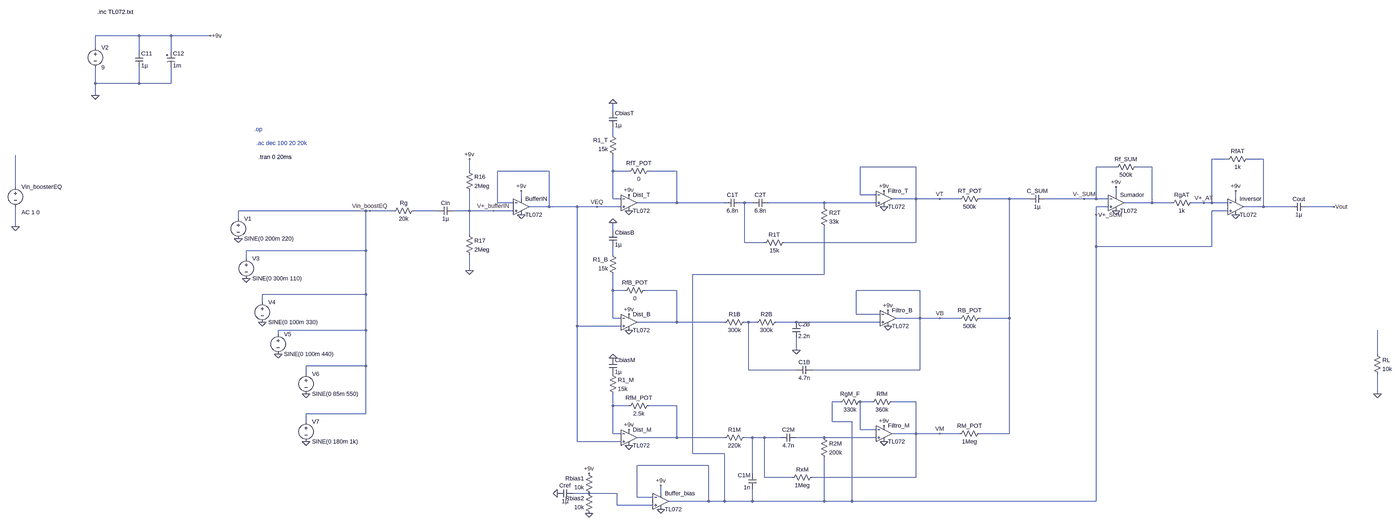
[diagram p0: schematic booster_eq.asc, whole sheet]
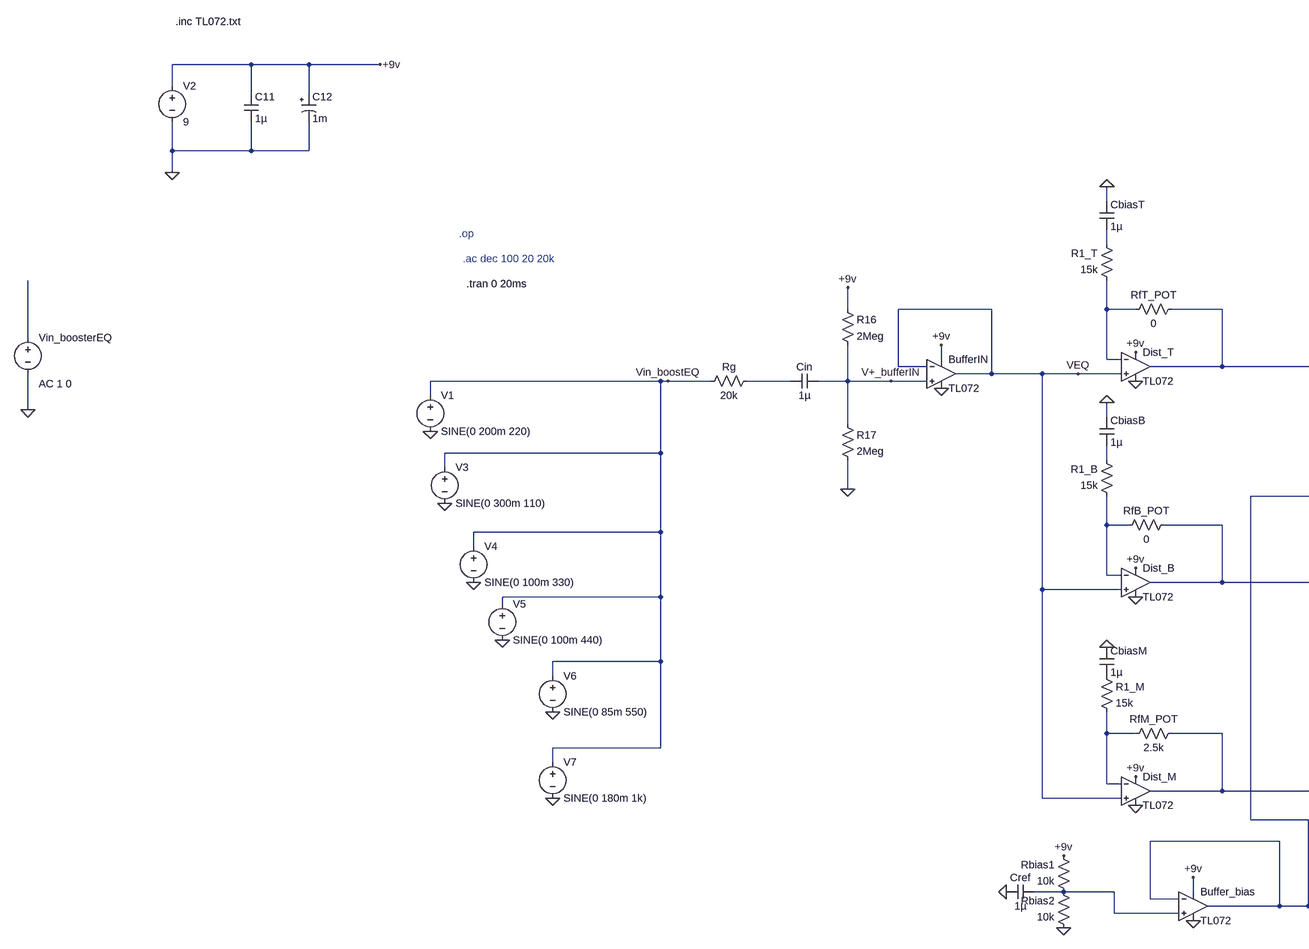
[diagram p1: schematic booster_eq.asc, part, row 1 of 1, column 1 of 2]
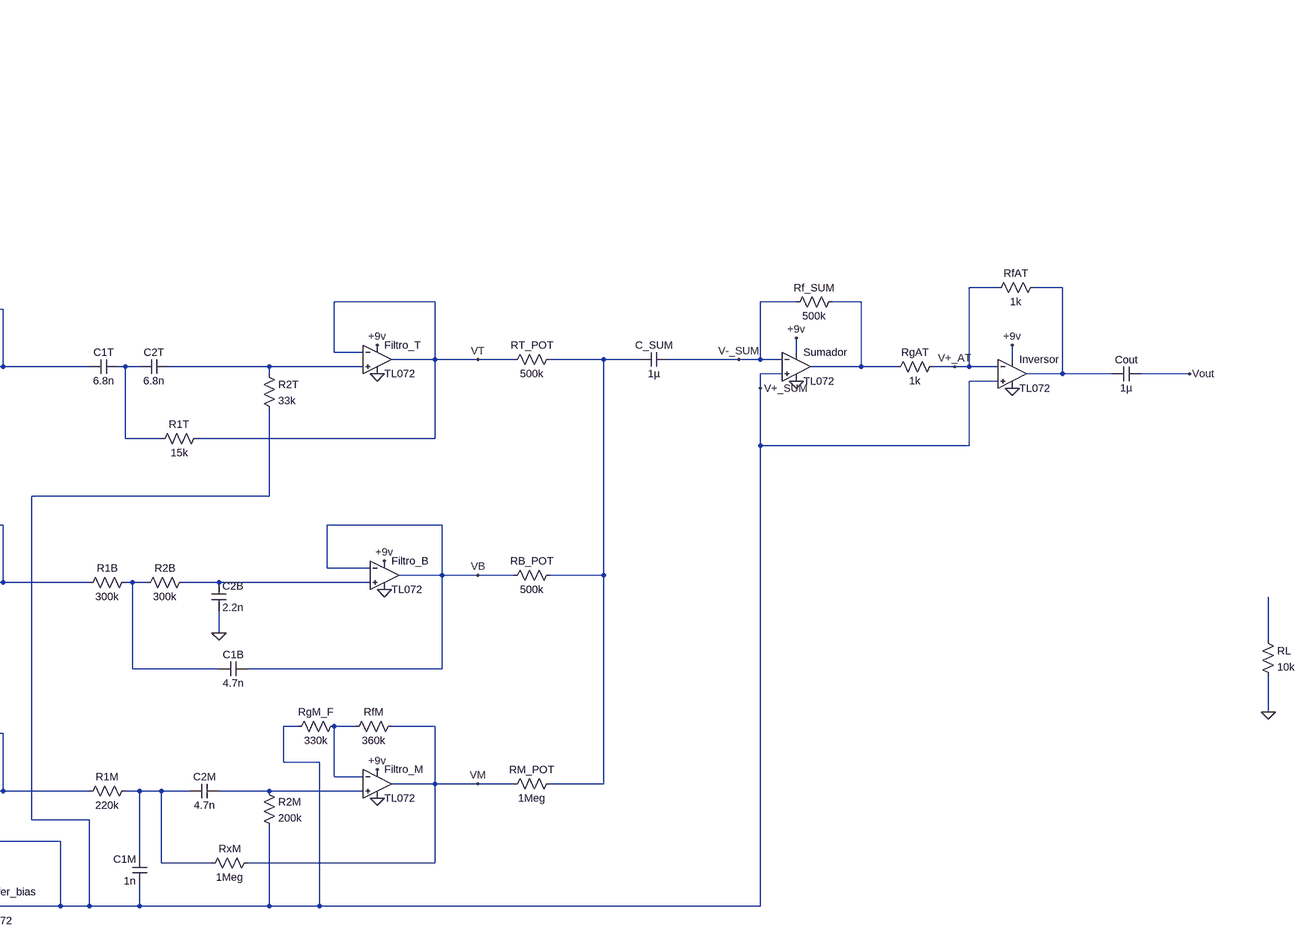
[diagram p2: schematic booster_eq.asc, part, row 1 of 1, column 2 of 2]
booster_eq.asc, the LTspice schematic file:
Version 4
SHEET 1 6752 4672
WIRE -2848 -16 -3024 -16
WIRE -2720 -16 -2848 -16
WIRE -2512 -16 -2720 -16
WIRE -3024 32 -3024 -16
WIRE -2848 48 -2848 -16
WIRE -2720 48 -2720 -16
WIRE -3024 176 -3024 112
WIRE -2848 176 -2848 112
WIRE -2848 176 -3024 176
WIRE -2720 176 -2720 112
WIRE -2720 176 -2848 176
WIRE -3024 224 -3024 176
WIRE -896 288 -896 256
WIRE -896 384 -896 352
WIRE 1600 480 1536 480
WIRE 1744 480 1680 480
WIRE 320 512 96 512
WIRE 1152 512 1072 512
WIRE 1296 512 1232 512
WIRE -1472 528 -1472 480
WIRE -1152 528 -1360 528
WIRE -896 528 -896 464
WIRE -832 528 -896 528
WIRE -640 528 -752 528
WIRE -3408 592 -3408 464
WIRE 96 624 96 512
WIRE 160 624 96 624
WIRE 1152 624 1152 592
WIRE -1264 640 -1264 608
WIRE -896 640 -896 528
WIRE -864 640 -896 640
WIRE 320 640 320 512
WIRE 320 640 224 640
WIRE 416 640 320 640
WIRE 496 640 416 640
WIRE 720 640 576 640
WIRE 800 640 720 640
WIRE 1024 640 864 640
WIRE 1072 640 1072 512
WIRE 1072 640 1024 640
WIRE 1120 640 1072 640
WIRE 1632 640 1632 608
WIRE -1360 656 -1360 528
WIRE -1296 656 -1360 656
WIRE -640 656 -640 528
WIRE -640 656 -800 656
WIRE -448 656 -640 656
WIRE -368 656 -384 656
WIRE -336 656 -368 656
WIRE -48 656 -272 656
WIRE 160 656 -48 656
WIRE 1296 656 1296 512
WIRE 1296 656 1184 656
WIRE 1376 656 1296 656
WIRE 1504 656 1456 656
WIRE 1536 656 1536 480
WIRE 1536 656 1504 656
WIRE 1600 656 1536 656
WIRE -1152 672 -1152 528
WIRE -1152 672 -1232 672
WIRE -1040 672 -1152 672
WIRE -960 672 -1040 672
WIRE -864 672 -960 672
WIRE -48 672 -48 656
WIRE 1120 672 1072 672
WIRE 1744 672 1744 480
WIRE 1744 672 1664 672
WIRE 1872 672 1744 672
WIRE 2128 672 1936 672
WIRE -1888 688 -2400 688
WIRE -1872 688 -1888 688
WIRE -1776 688 -1872 688
WIRE -1600 688 -1696 688
WIRE -1472 688 -1472 608
WIRE -1472 688 -1536 688
WIRE -1376 688 -1472 688
WIRE -1296 688 -1376 688
WIRE 1600 688 1536 688
WIRE 1072 704 1072 672
WIRE -2400 720 -2400 688
WIRE -3408 752 -3408 672
WIRE -896 768 -896 736
WIRE -1472 784 -1472 688
WIRE -368 816 -368 656
WIRE -288 816 -368 816
WIRE 320 816 320 640
WIRE 320 816 -208 816
WIRE 1072 832 1072 704
WIRE 1536 832 1536 688
WIRE 1536 832 1072 832
WIRE -1888 848 -1888 688
WIRE -1888 848 -2368 848
WIRE -896 864 -896 832
WIRE -2368 880 -2368 848
WIRE -1472 928 -1472 864
WIRE -48 944 -48 752
WIRE -48 944 -576 944
WIRE -896 1008 -896 944
WIRE -848 1008 -896 1008
WIRE -640 1008 -768 1008
WIRE 336 1008 80 1008
WIRE -1888 1024 -1888 848
WIRE -1888 1024 -2304 1024
WIRE -2304 1056 -2304 1024
WIRE 80 1104 80 1008
WIRE 176 1104 80 1104
WIRE -896 1120 -896 1008
WIRE -864 1120 -896 1120
WIRE 336 1120 336 1008
WIRE 336 1120 240 1120
WIRE 416 1120 336 1120
WIRE 496 1120 416 1120
WIRE 720 1120 720 640
WIRE 720 1120 576 1120
WIRE -640 1136 -640 1008
WIRE -640 1136 -800 1136
WIRE -448 1136 -640 1136
WIRE -352 1136 -368 1136
WIRE -320 1136 -352 1136
WIRE -160 1136 -240 1136
WIRE 176 1136 -160 1136
WIRE -1040 1152 -1040 672
WIRE -864 1152 -1040 1152
WIRE -1888 1168 -1888 1024
WIRE -1888 1168 -2240 1168
WIRE -2240 1184 -2240 1168
WIRE -160 1248 -160 1200
WIRE 2736 1264 2736 1168
WIRE -1888 1312 -1888 1168
WIRE -1888 1312 -2128 1312
WIRE -352 1328 -352 1136
WIRE -160 1328 -352 1328
WIRE 336 1328 336 1120
WIRE 336 1328 -96 1328
WIRE -2128 1344 -2128 1312
WIRE 2736 1424 2736 1344
WIRE 16 1456 -16 1456
WIRE 144 1456 96 1456
WIRE 320 1456 224 1456
WIRE -896 1472 -896 1424
WIRE -832 1472 -896 1472
WIRE -640 1472 -752 1472
WIRE -1888 1504 -1888 1312
WIRE -1888 1504 -2128 1504
WIRE -2128 1536 -2128 1504
WIRE -16 1536 -16 1456
WIRE 64 1536 -16 1536
WIRE 96 1568 96 1456
WIRE 160 1568 96 1568
WIRE -896 1584 -896 1472
WIRE -864 1584 -896 1584
WIRE 320 1584 320 1456
WIRE 320 1584 224 1584
WIRE 416 1584 320 1584
WIRE 496 1584 416 1584
WIRE 720 1584 720 1120
WIRE 720 1584 576 1584
WIRE -640 1600 -640 1472
WIRE -640 1600 -800 1600
WIRE -448 1600 -640 1600
WIRE -336 1600 -368 1600
WIRE -288 1600 -336 1600
WIRE -224 1600 -288 1600
WIRE -48 1600 -160 1600
WIRE 160 1600 -48 1600
WIRE -1040 1616 -1040 1152
WIRE -864 1616 -1040 1616
WIRE -576 1664 -576 944
WIRE -448 1664 -576 1664
WIRE -512 1712 -800 1712
WIRE -336 1744 -336 1600
WIRE -288 1760 -288 1600
WIRE -176 1760 -288 1760
WIRE 320 1760 320 1584
WIRE 320 1760 -96 1760
WIRE -992 1824 -1056 1824
WIRE -880 1824 -992 1824
WIRE -704 1824 -704 1792
WIRE -800 1840 -800 1712
WIRE -736 1840 -800 1840
WIRE -512 1856 -512 1712
WIRE -512 1856 -672 1856
WIRE -448 1856 -448 1664
WIRE -448 1856 -512 1856
WIRE -336 1856 -336 1808
WIRE -336 1856 -448 1856
WIRE -48 1856 -48 1680
WIRE -48 1856 -336 1856
WIRE 64 1856 64 1536
WIRE 64 1856 -48 1856
WIRE 1072 1856 1072 832
WIRE 1072 1856 64 1856
WIRE -880 1872 -880 1824
WIRE -736 1872 -880 1872
FLAG -1472 928 0
FLAG -1472 480 +9v
FLAG -2512 -16 +9v
FLAG -832 688 0
FLAG -832 624 +9v
FLAG -3024 224 0
FLAG 1152 688 0
FLAG 1152 592 +9v
FLAG 416 640 VT
FLAG 416 1120 VB
FLAG -832 1168 0
FLAG -832 1104 +9v
FLAG 1072 704 V+_SUM
FLAG 1024 640 V-_SUM
FLAG 192 608 +9v
FLAG 208 1152 0
FLAG 208 1088 +9v
FLAG -160 1248 0
FLAG 192 672 0
FLAG -1264 704 0
FLAG -1264 608 +9v
FLAG -832 1632 0
FLAG -832 1568 +9v
FLAG 416 1584 VM
FLAG 192 1552 +9v
FLAG 192 1616 0
FLAG -896 256 0
FLAG -896 736 0
FLAG 2128 672 Vout
FLAG 1632 704 0
FLAG 1632 608 +9v
FLAG -992 1744 +9v
FLAG -1120 1824 0
FLAG -896 1280 0
FLAG -992 1904 0
FLAG -704 1888 0
FLAG -704 1792 +9v
FLAG -2400 800 0
FLAG -2368 960 0
FLAG -2304 1136 0
FLAG -2240 1264 0
FLAG -2128 1424 0
FLAG -3408 752 0
FLAG 2736 1424 0
FLAG -1376 688 V+_bufferIN
FLAG 1504 656 V+_AT
FLAG -960 672 VEQ
FLAG -1872 688 Vin_boostEQ
FLAG -2128 1616 0
SYMBOL Res -1488 512 R0
SYMATTR InstName R16
SYMATTR Value 2Meg
SYMBOL Res -1488 768 R0
SYMATTR InstName R17
SYMATTR Value 2Meg
SYMBOL Cap -1536 672 R90
WINDOW 0 0 32 VBottom 2
WINDOW 3 32 32 VTop 2
SYMATTR InstName Cin
SYMATTR Value 1µ
SYMBOL Voltage -3024 16 R0
SYMATTR InstName V2
SYMATTR Value 9
SYMBOL Cap -2864 48 R0
SYMATTR InstName C11
SYMATTR Value 1µ
SYMBOL polcap -2736 48 R0
WINDOW 3 24 56 Left 2
SYMATTR Value 1m
SYMATTR InstName C12
SYMATTR Description Capacitor
SYMATTR Type cap
SYMATTR SpiceLine Rser=85m Lser=0 mfg="Nichicon" pn="UPL0J102MRH6" type="Al electrolytic"
SYMBOL OpAmps/opamp2 -832 592 R0
SYMATTR InstName Dist_T
SYMATTR Value TL072
SYMBOL Res 592 624 R90
WINDOW 0 0 56 VBottom 2
WINDOW 3 32 56 VTop 2
SYMATTR InstName RT_POT
SYMATTR Value 500k
SYMBOL Res 592 1104 R90
WINDOW 0 0 56 VBottom 2
WINDOW 3 32 56 VTop 2
SYMATTR InstName RB_POT
SYMATTR Value 500k
SYMBOL OpAmps/opamp2 1152 592 R0
SYMATTR InstName Sumador
SYMATTR Value TL072
SYMBOL Res 1248 496 R90
WINDOW 0 0 56 VBottom 2
WINDOW 3 32 56 VTop 2
SYMATTR InstName Rf_SUM
SYMATTR Value 500k
SYMBOL OpAmps/opamp2 -832 1072 R0
SYMATTR InstName Dist_B
SYMATTR Value TL072
SYMBOL Voltage -2368 864 R0
SYMATTR InstName V3
SYMATTR Value SINE(0 300m 110)
SYMBOL Cap 864 624 R90
WINDOW 0 0 32 VBottom 2
WINDOW 3 32 32 VTop 2
SYMATTR InstName C_SUM
SYMATTR Value 1µ
SYMBOL Res -352 1120 R90
WINDOW 0 0 56 VBottom 2
WINDOW 3 32 56 VTop 2
SYMATTR InstName R1B
SYMATTR Value 300k
SYMBOL Res -224 1120 R90
WINDOW 0 0 56 VBottom 2
WINDOW 3 32 56 VTop 2
SYMATTR InstName R2B
SYMATTR Value 300k
SYMBOL Cap -176 1136 R0
SYMATTR InstName C2B
SYMATTR Value 2.2n
SYMBOL Cap -384 640 R90
WINDOW 0 0 32 VBottom 2
WINDOW 3 32 32 VTop 2
SYMATTR InstName C1T
SYMATTR Value 6.8n
SYMBOL Cap -272 640 R90
WINDOW 0 0 32 VBottom 2
WINDOW 3 32 32 VTop 2
SYMATTR InstName C2T
SYMATTR Value 6.8n
SYMBOL Res -64 656 R0
SYMATTR InstName R2T
SYMATTR Value 33k
SYMBOL OpAmps/opamp2 192 576 R0
SYMATTR InstName Filtro_T
SYMATTR Value TL072
SYMBOL OpAmps/opamp2 208 1056 R0
SYMATTR InstName Filtro_B
SYMATTR Value TL072
SYMBOL Res -192 800 R90
WINDOW 0 0 56 VBottom 2
WINDOW 3 32 56 VTop 2
SYMATTR InstName R1T
SYMATTR Value 15k
SYMBOL Cap -96 1312 R90
WINDOW 0 0 32 VBottom 2
WINDOW 3 32 32 VTop 2
SYMATTR InstName C1B
SYMATTR Value 4.7n
SYMBOL OpAmps/opamp2 -1264 608 R0
SYMATTR InstName BufferIN
SYMATTR Value TL072
SYMBOL OpAmps/opamp2 -832 1536 R0
SYMATTR InstName Dist_M
SYMATTR Value TL072
SYMBOL Res 592 1568 R90
WINDOW 0 0 56 VBottom 2
WINDOW 3 32 56 VTop 2
SYMATTR InstName RM_POT
SYMATTR Value 1Meg
SYMBOL Cap -320 1808 R180
WINDOW 0 24 56 Left 2
WINDOW 3 24 8 Left 2
SYMATTR InstName C1M
SYMATTR Value 1n
SYMBOL Cap -160 1584 R90
WINDOW 0 0 32 VBottom 2
WINDOW 3 32 32 VTop 2
SYMATTR InstName C2M
SYMATTR Value 4.7n
SYMBOL Res -64 1584 R0
SYMATTR InstName R2M
SYMATTR Value 200k
SYMBOL OpAmps/opamp2 192 1520 R0
SYMATTR InstName Filtro_M
SYMATTR Value TL072
SYMBOL Res -80 1744 R90
WINDOW 0 0 56 VBottom 2
WINDOW 3 32 56 VTop 2
SYMATTR InstName RxM
SYMATTR Value 1Meg
SYMBOL Res 240 1440 R90
WINDOW 0 0 56 VBottom 2
WINDOW 3 32 56 VTop 2
SYMATTR InstName RfM
SYMATTR Value 360k
SYMBOL Res -752 992 R90
WINDOW 0 0 56 VBottom 2
WINDOW 3 32 56 VTop 2
SYMATTR InstName RfB_POT
SYMATTR Value 0
SYMBOL Res -736 512 R90
WINDOW 0 0 56 VBottom 2
WINDOW 3 32 56 VTop 2
SYMATTR InstName RfT_POT
SYMATTR Value 0
SYMBOL Res -880 960 R180
WINDOW 0 36 76 Left 2
WINDOW 3 36 40 Left 2
SYMATTR InstName R1_B
SYMATTR Value 15k
SYMBOL Res -880 480 R180
WINDOW 0 36 76 Left 2
WINDOW 3 36 40 Left 2
SYMATTR InstName R1_T
SYMATTR Value 15k
SYMBOL Cap -912 288 R0
SYMATTR InstName CbiasT
SYMATTR Value 1µ
SYMBOL Cap -912 768 R0
SYMATTR InstName CbiasB
SYMATTR Value 1µ
SYMBOL OpAmps/opamp2 1632 608 R0
SYMATTR InstName Inversor
SYMATTR Value TL072
SYMBOL Res 1696 464 R90
WINDOW 0 0 56 VBottom 2
WINDOW 3 32 56 VTop 2
SYMATTR InstName RfAT
SYMATTR Value 1k
SYMBOL Res 1360 672 R270
WINDOW 0 32 56 VTop 2
WINDOW 3 0 56 VBottom 2
SYMATTR InstName RgAT
SYMATTR Value 1k
SYMBOL Res -352 1584 R90
WINDOW 0 0 56 VBottom 2
WINDOW 3 32 56 VTop 2
SYMATTR InstName R1M
SYMATTR Value 220k
SYMBOL Res -976 1920 R180
WINDOW 0 36 76 Left 2
WINDOW 3 36 40 Left 2
SYMATTR InstName Rbias2
SYMATTR Value 10k
SYMBOL Res -976 1840 R180
WINDOW 0 36 76 Left 2
WINDOW 3 36 40 Left 2
SYMATTR InstName Rbias1
SYMATTR Value 10k
SYMBOL Cap -1056 1808 R90
WINDOW 0 0 32 VBottom 2
WINDOW 3 32 32 VTop 2
SYMATTR InstName Cref
SYMATTR Value 1µ
SYMBOL Res 112 1440 R90
WINDOW 0 0 56 VBottom 2
WINDOW 3 32 56 VTop 2
SYMATTR InstName RgM_F
SYMATTR Value 330k
SYMBOL Res -912 1328 R0
SYMATTR InstName R1_M
SYMATTR Value 15k
SYMBOL Cap -912 1280 R0
SYMATTR InstName CbiasM
SYMATTR Value 1µ
SYMBOL Res -736 1456 R90
WINDOW 0 0 56 VBottom 2
WINDOW 3 32 56 VTop 2
SYMATTR InstName RfM_POT
SYMATTR Value 2.5k
SYMBOL Cap 1936 656 R90
WINDOW 0 0 32 VBottom 2
WINDOW 3 32 32 VTop 2
SYMATTR InstName Cout
SYMATTR Value 1µ
SYMBOL OpAmps/opamp2 -704 1792 R0
SYMATTR InstName Buffer_bias
SYMATTR Value TL072
SYMBOL Voltage -2400 704 R0
SYMATTR InstName V1
SYMATTR Value SINE(0 200m 220)
SYMBOL Voltage -2304 1040 R0
SYMATTR InstName V4
SYMATTR Value SINE(0 100m 330)
SYMBOL Voltage -2240 1168 R0
SYMATTR InstName V5
SYMATTR Value SINE(0 100m 440)
SYMBOL Voltage -2128 1328 R0
SYMATTR InstName V6
SYMATTR Value SINE(0 85m 550)
SYMBOL Res -1680 672 R90
WINDOW 0 0 56 VBottom 2
WINDOW 3 32 56 VTop 2
SYMATTR InstName Rg
SYMATTR Value 20k
SYMBOL Voltage -3408 576 R0
WINDOW 123 24 118 Left 2
WINDOW 3 24 96 Invisible 2
SYMATTR Value2 AC 1 0
SYMATTR Value SINE(0 100m 450)
SYMATTR InstName Vin_boosterEQ
SYMBOL Res 2720 1248 R0
SYMATTR InstName RL
SYMATTR Value 10k
SYMBOL Voltage -2128 1520 R0
SYMATTR InstName V7
SYMATTR Value SINE(0 180m 1k)
TEXT -3016 -112 Left 2 !.inc TL072.txt
TEXT -2336 360 Left 2 ;.op
TEXT -2328 416 Left 2 ;.ac dec 100 20 20k
TEXT -2320 472 Left 2 !.tran 0 20ms

The netlist it stands for:
* booster_eq.asc
R16 +9v V+_bufferIN 2Meg
R17 V+_bufferIN 0 2Meg
Cin V+_bufferIN N010 1µ
V2 +9v 0 9
C11 +9v 0 1µ
C12 +9v 0 1m Rser=85m Lser=0 mfg="Nichicon" pn="UPL0J102MRH6" type="Al electrolytic"
XDist_T VEQ N004 +9v 0 N005 TL072  ; pins In+ In- V+ V- OUT
RT_POT N007 VT 500k
RB_POT N007 VB 500k
XSumador V+_SUM V-_SUM +9v 0 N003 TL072  ; pins In+ In- V+ V- OUT
Rf_SUM N003 V-_SUM 500k
XDist_B VEQ N012 +9v 0 N013 TL072  ; pins In+ In- V+ V- OUT
V3 Vin_boostEQ 0 SINE(0 300m 110)
C_SUM V-_SUM N007 1µ
R1B N014 N013 300k
R2B N015 N014 300k
C2B N015 0 2.2n
C1T N008 N005 6.8n
C2T N009 N008 6.8n
R2T N009 V+_SUM 33k
XFiltro_T N009 VT +9v 0 VT TL072  ; pins In+ In- V+ V- OUT
XFiltro_B N015 VB +9v 0 VB TL072  ; pins In+ In- V+ V- OUT
R1T VT N008 15k
C1B VB N014 4.7n
XBufferIN V+_bufferIN VEQ +9v 0 VEQ TL072  ; pins In+ In- V+ V- OUT
XDist_M VEQ N018 +9v 0 N019 TL072  ; pins In+ In- V+ V- OUT
RM_POT N007 VM 1Meg
C1M V+_SUM N020 1n
C2M N021 N020 4.7n
R2M N021 V+_SUM 200k
XFiltro_M N021 N017 +9v 0 VM TL072  ; pins In+ In- V+ V- OUT
RxM VM N020 1Meg
RfM VM N017 360k
RfB_POT N013 N012 0
RfT_POT N005 N004 0
R1_B N012 N011 15k
R1_T N004 N001 15k
CbiasT 0 N001 1µ
CbiasB 0 N011 1µ
XInversor V+_SUM V+_AT +9v 0 N002 TL072  ; pins In+ In- V+ V- OUT
RfAT N002 V+_AT 1k
RgAT N003 V+_AT 1k
R1M N020 N019 220k
Rbias2 0 N022 10k
Rbias1 N022 +9v 10k
Cref N022 0 1µ
RgM_F N017 V+_SUM 330k
R1_M P001 N018 15k
CbiasM 0 P001 1µ
RfM_POT N019 N018 2.5k
Cout Vout N002 1µ
XBuffer_bias N022 V+_SUM +9v 0 V+_SUM TL072  ; pins In+ In- V+ V- OUT
V1 Vin_boostEQ 0 SINE(0 200m 220)
V4 Vin_boostEQ 0 SINE(0 100m 330)
V5 Vin_boostEQ 0 SINE(0 100m 440)
V6 Vin_boostEQ 0 SINE(0 85m 550)
Rg N010 Vin_boostEQ 20k
Vin_boosterEQ N006 0 SINE(0 100m 450) AC 1 0
RL N016 0 10k
V7 Vin_boostEQ 0 SINE(0 180m 1k)
.inc TL072.txt
* .op
* .ac dec 100 20 20k
.tran 0 20ms
.backanno
.end